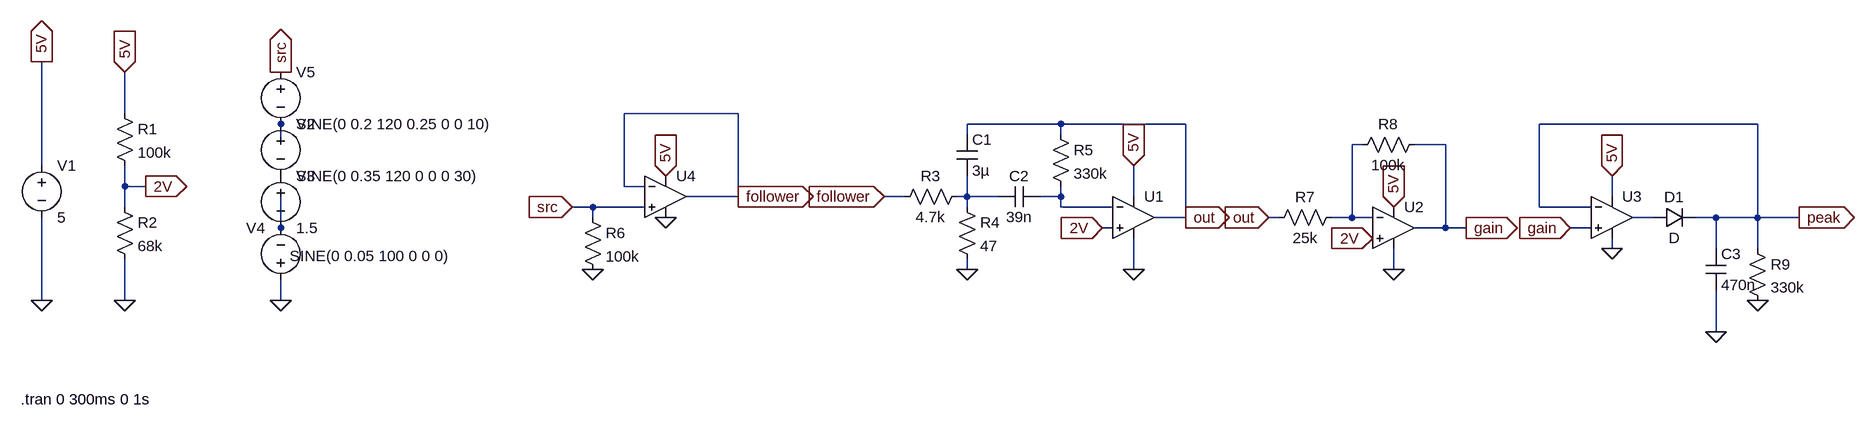
[diagram p0: schematic 301_model.asc]
301_model.asc, the LTspice schematic file:
Version 4
SHEET 1 1876 776
WIRE -1056 192 -1056 128
WIRE -112 192 -288 192
WIRE 384 208 240 208
WIRE 576 208 384 208
WIRE 1456 208 1120 208
WIRE 240 224 240 208
WIRE 384 224 384 208
WIRE -816 240 -816 208
WIRE 848 240 832 240
WIRE 976 240 928 240
WIRE -1184 272 -1184 112
WIRE -1056 304 -1056 272
WIRE -1024 304 -1056 304
WIRE -288 304 -288 192
WIRE -256 304 -288 304
WIRE -112 320 -112 192
WIRE -112 320 -192 320
WIRE 144 320 112 320
WIRE 240 320 240 288
WIRE 240 320 224 320
WIRE 288 320 240 320
WIRE 384 320 384 304
WIRE 384 320 352 320
WIRE 496 320 496 272
WIRE 1232 320 1232 288
WIRE -1056 336 -1056 304
WIRE -336 336 -368 336
WIRE -256 336 -336 336
WIRE 240 336 240 320
WIRE 384 336 384 320
WIRE 464 336 384 336
WIRE 1120 336 1120 208
WIRE 1200 336 1120 336
WIRE -336 352 -336 336
WIRE 576 352 576 208
WIRE 576 352 528 352
WIRE 720 352 704 352
WIRE 832 352 832 240
WIRE 832 352 800 352
WIRE 864 352 832 352
WIRE 1296 352 1264 352
WIRE 1392 352 1360 352
WIRE 1456 352 1456 208
WIRE 1456 352 1392 352
WIRE 1520 352 1456 352
WIRE -816 368 -816 320
WIRE 464 368 448 368
WIRE 976 368 976 240
WIRE 976 368 928 368
WIRE 1008 368 976 368
WIRE 1200 368 1168 368
WIRE 1232 400 1232 384
WIRE 1392 400 1392 352
WIRE 1456 400 1456 352
WIRE 240 432 240 416
WIRE 496 432 496 384
WIRE 896 432 896 400
WIRE -1184 480 -1184 352
WIRE -1056 480 -1056 416
WIRE -816 480 -816 448
WIRE 1392 528 1392 464
FLAG -1184 480 0
FLAG -1184 112 5V
IOPIN -1184 112 Out
FLAG 496 272 5V
IOPIN 496 272 In
FLAG -1056 480 0
FLAG -1056 128 5V
IOPIN -1056 128 In
FLAG -1024 304 2V
IOPIN -1024 304 Out
FLAG 448 368 2V
IOPIN 448 368 In
FLAG 496 432 0
FLAG 240 432 0
FLAG -816 128 src
IOPIN -816 128 Out
FLAG -368 336 src
IOPIN -368 336 In
FLAG 576 352 out
IOPIN 576 352 Out
FLAG -336 432 0
FLAG 896 336 5V
IOPIN 896 336 In
FLAG 896 432 0
FLAG 704 352 out
IOPIN 704 352 In
FLAG 1008 368 gain
IOPIN 1008 368 Out
FLAG 864 384 2V
IOPIN 864 384 In
FLAG 1232 400 0
FLAG 1232 288 5V
IOPIN 1232 288 In
FLAG 1168 368 gain
IOPIN 1168 368 In
FLAG 1520 352 peak
IOPIN 1520 352 Out
FLAG 1392 528 0
FLAG 1456 480 0
FLAG -816 480 0
FLAG -224 288 5V
IOPIN -224 288 In
FLAG -224 352 0
FLAG -112 320 follower
IOPIN -112 320 Out
FLAG 112 320 follower
IOPIN 112 320 In
SYMBOL Opamps\\UniversalOpamp2 496 352 R0
SYMATTR InstName U1
SYMBOL voltage -1184 256 R0
WINDOW 123 0 0 Left 2
WINDOW 39 0 0 Left 2
SYMATTR InstName V1
SYMATTR Value 5
SYMBOL res -1072 176 R0
SYMATTR InstName R1
SYMATTR Value 100k
SYMBOL res -1072 320 R0
SYMATTR InstName R2
SYMATTR Value 68k
SYMBOL res 240 304 R90
WINDOW 0 0 56 VBottom 2
WINDOW 3 32 56 VTop 2
SYMATTR InstName R3
SYMATTR Value 4.7k
SYMBOL res 224 320 R0
SYMATTR InstName R4
SYMATTR Value 47
SYMBOL cap 224 224 R0
SYMATTR InstName C1
SYMATTR Value 3µ
SYMBOL cap 352 304 R90
WINDOW 0 0 32 VBottom 2
WINDOW 3 32 32 VTop 2
SYMATTR InstName C2
SYMATTR Value 39n
SYMBOL res 368 208 R0
SYMATTR InstName R5
SYMATTR Value 330k
SYMBOL voltage -816 192 R0
WINDOW 123 0 0 Left 2
WINDOW 39 0 0 Left 2
SYMATTR InstName V2
SYMATTR Value SINE(0 0.35 120 0 0 0 30)
SYMBOL voltage -816 272 R0
WINDOW 123 0 0 Left 2
WINDOW 39 0 0 Left 2
SYMATTR InstName V3
SYMATTR Value 1.5
SYMBOL res -352 336 R0
SYMATTR InstName R6
SYMATTR Value 100k
SYMBOL Opamps\\UniversalOpamp2 896 368 R0
SYMATTR InstName U2
SYMBOL res 816 336 R90
WINDOW 0 0 56 VBottom 2
WINDOW 3 32 56 VTop 2
SYMATTR InstName R7
SYMATTR Value 25k
SYMBOL res 944 224 R90
WINDOW 0 0 56 VBottom 2
WINDOW 3 32 56 VTop 2
SYMATTR InstName R8
SYMATTR Value 100k
SYMBOL Opamps\\UniversalOpamp2 1232 352 R0
SYMATTR InstName U3
SYMBOL diode 1296 368 R270
WINDOW 0 32 32 VTop 2
WINDOW 3 0 32 VBottom 2
SYMATTR InstName D1
SYMBOL cap 1376 400 R0
SYMATTR InstName C3
SYMATTR Value 470n
SYMBOL res 1440 384 R0
SYMATTR InstName R9
SYMATTR Value 330k
SYMBOL voltage -816 464 R180
WINDOW 0 24 96 Left 2
WINDOW 3 -261 53 Left 2
WINDOW 123 0 0 Left 2
WINDOW 39 0 0 Left 2
SYMATTR InstName V4
SYMATTR Value SINE(0 0.05 100 0 0 0)
SYMBOL Opamps\\UniversalOpamp2 -224 320 R0
SYMATTR InstName U4
SYMBOL voltage -816 112 R0
WINDOW 123 0 0 Left 2
WINDOW 39 0 0 Left 2
SYMATTR InstName V5
SYMATTR Value SINE(0 0.2 120 0.25 0 0 10)
TEXT -1216 632 Left 2 !.tran 0 300ms 0 1s

The netlist it stands for:
* 301_model.asc
XU1 2V N004 5V 0 out level.2 Avol=1Meg GBW=10Meg Slew=10Meg ilimit=25m rail=0 Vos=0 phimargin=45 en=0 enk=0 in=0 ink=0 Rin=500Meg  ; pins IN+ IN- V+ V- OUT
V1 5V 0 5
R1 5V 2V 100k
R2 2V 0 68k
R3 N003 follower 4.7k
R4 N003 0 47
C1 out N003 3µ
C2 N004 N003 39n
R5 out N004 330k
V2 N001 P001 SINE(0 0.35 120 0 0 0 30)
V3 P001 N006 1.5
R6 src 0 100k
XU2 2V N002 5V 0 gain level.2 Avol=1Meg GBW=10Meg Slew=10Meg ilimit=25m rail=0 Vos=0 phimargin=45 en=0 enk=0 in=0 ink=0 Rin=500Meg  ; pins IN+ IN- V+ V- OUT
R7 N002 out 25k
R8 gain N002 100k
XU3 gain peak 5V 0 N005 level.2 Avol=1Meg GBW=10Meg Slew=10Meg ilimit=25m rail=0 Vos=0 phimargin=45 en=0 enk=0 in=0 ink=0 Rin=500Meg  ; pins IN+ IN- V+ V- OUT
D1 N005 peak D
C3 peak 0 470n
R9 peak 0 330k
V4 0 N006 SINE(0 0.05 100 0 0 0)
XU4 src follower 5V 0 follower level.2 Avol=1Meg GBW=10Meg Slew=10Meg ilimit=25m rail=0 Vos=0 phimargin=45 en=0 enk=0 in=0 ink=0 Rin=500Meg  ; pins IN+ IN- V+ V- OUT
V5 src N001 SINE(0 0.2 120 0.25 0 0 10)
.model D D
.lib standard.dio
.tran 0 300ms 0 1s
.lib UniversalOpamps2.sub
.backanno
.end